# Altium schematic sheet mcu.SchDoc
size A; SheetNumber: 2; SheetTotal: 3; SPICEModelCacheWLBWUGVA: <root> / <DocumentId>WLBWUGVA</DocumentId> / </root>
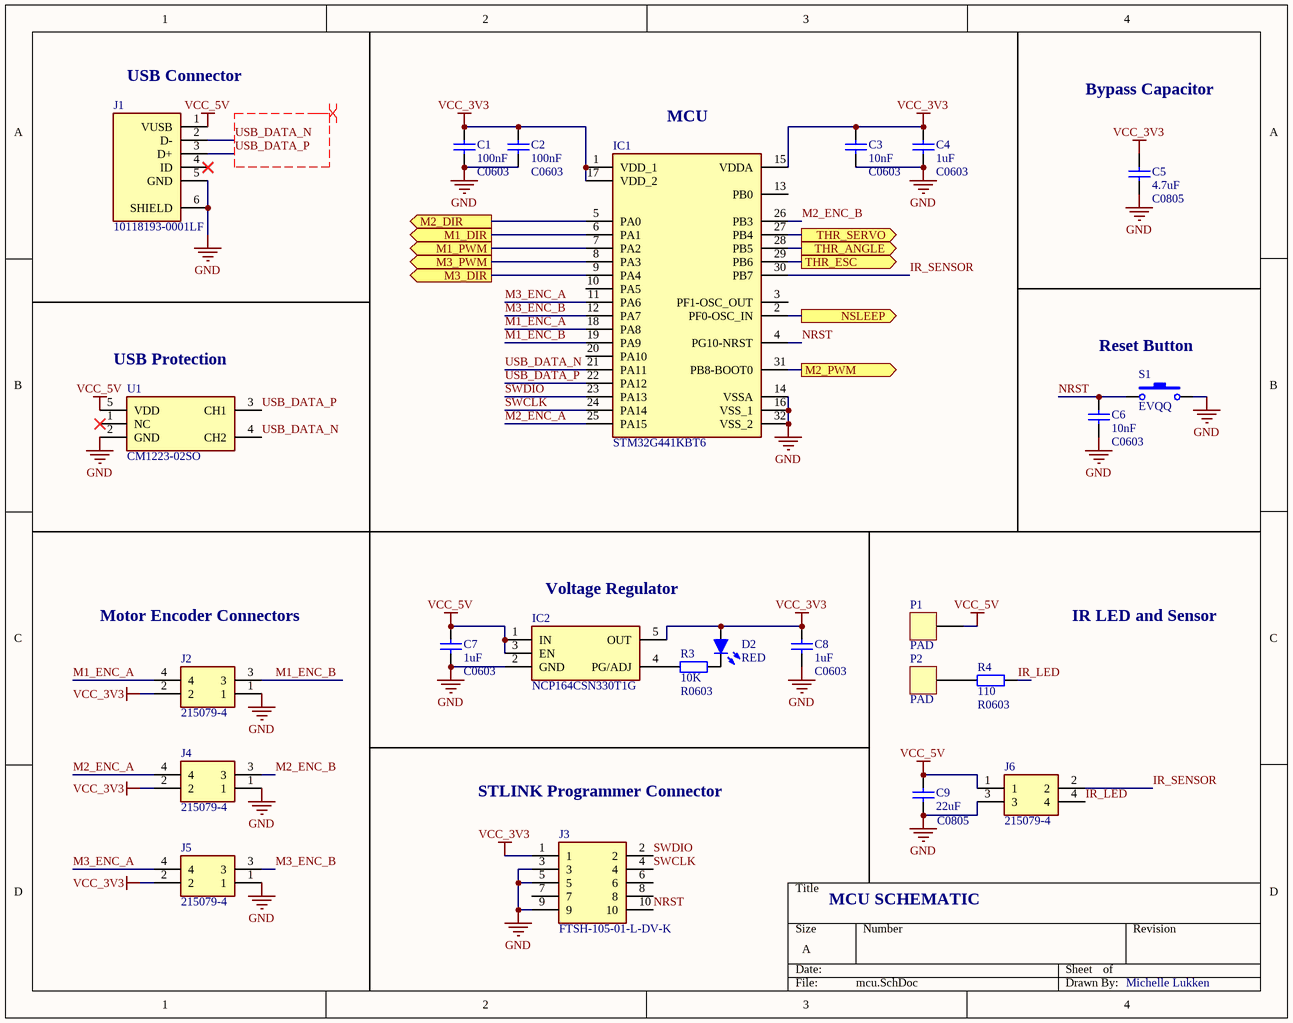
[diagram p0: mcu.SchDoc]

## Parts
C1  Capacitance: 100nF  [C0603]
C2  Capacitance: 100nF  [C0603]
C3  Capacitance: 10nF  [C0603]
C4  Capacitance: 1uF  [C0603]
C5  Capacitance: 4.7uF  [C0805]
C6  Capacitance: 10nF  [C0603]
C7  Capacitance: 1uF  [C0603]
C8  Capacitance: 1uF  [C0603]
C9  Capacitance: 22uF  [C0805]
D2  Colour: RED  [LED_0603]  (hidden comment: LED)
IC1  STM32G441KBT6  [QFP80P900X900X160-32N]
IC2  NCP164CSN330T1G  [SOT95P275X110-5N]
J1  10118193-0001LF  [101181930001LF]
J2  215079-4  [2150794]
J3  FTSH-105-01-L-DV-K  [FTSH10501LDVK]
J4  215079-4  [2150794]
J5  215079-4  [2150794]
J6  215079-4  [2150794]
P1  PAD  [PAD]
P2  PAD  [PAD]
R3  10K  [R0603]
R4  110  [R0603]
S1  EVQQ  [EVQQ]
U1  CM1223-02SO  [SOT95P280X145-5N]

## Ports
M1_DIR (out, see top_overview[1A]), M1_PWM (out, see top_overview[1A]), M2_DIR (out, see top_overview[1B]), M2_PWM (out, see top_overview[1B]), M3_DIR (out, see top_overview[1B]), M3_PWM (out, see top_overview[1B]), NSLEEP (out, see top_overview[1A]), THR_ANGLE (out, see top_overview[1B]), THR_ESC (out, see top_overview[1B]), THR_SERVO (out, see top_overview[1B])

## Nets
GND: C1.1 C2.1 C3.1 C4.1 C5.1 C6.1 C7.1 C8.1 C9.2 IC1.14(VSSA) IC1.16(VSS_1) IC1.32(VSS_2) IC2.2(GND) J1.5(GND) J1.6(SHIELD) J2.1 J3.3 J3.5 J3.9 J4.1 J5.1 J6.3 S1.2 U1.2(GND)
VCC_3V3: C1.2 C2.2 C3.2 C4.2 C5.2 C8.2 D2.1(A) IC1.1(VDD_1) IC1.15(VDDA) IC1.17(VDD_2) IC2.5(OUT) J2.2 J3.1 J4.2 J5.2
VCC_5V: C7.2 C9.1 IC2.1(IN) IC2.3(EN) J1.1(VUSB) J6.1 P1.1(PAD) U1.5(VDD)
IR_LED: J6.4 R4.2
IR_SENSOR: IC1.30(PB7) J6.2
M1_DIR: IC1.6(PA1) ; port M1_DIR
M1_ENC_A: IC1.18(PA8) J2.4
M1_ENC_B: IC1.19(PA9) J2.3
M1_PWM: IC1.7(PA2) ; port M1_PWM
M2_DIR: IC1.5(PA0) ; port M2_DIR
M2_ENC_A: IC1.25(PA15) J4.4
M2_ENC_B: IC1.26(PB3) J4.3
M2_PWM: IC1.31(PB8-BOOT0) ; port M2_PWM
M3_DIR: IC1.9(PA4) ; port M3_DIR
M3_ENC_A: IC1.11(PA6) J5.4
M3_ENC_B: IC1.12(PA7) J5.3
M3_PWM: IC1.8(PA3) ; port M3_PWM
NRST: C6.2 IC1.4(PG10-NRST) J3.10 S1.1
NSLEEP: IC1.2(PF0-OSC_IN) ; port NSLEEP
SWCLK: IC1.24(PA14) J3.4
SWDIO: IC1.23(PA13) J3.2
THR_ANGLE: IC1.28(PB5) ; port THR_ANGLE
THR_ESC: IC1.29(PB6) ; port THR_ESC
THR_SERVO: IC1.27(PB4) ; port THR_SERVO
USB_DATA_N: IC1.21(PA11) J1.2(D-) U1.4(CH2)
USB_DATA_P: IC1.22(PA12) J1.3(D+) U1.3(CH1)
NetD2_2: D2.2(K) R3.1
NetIC2_4: IC2.4(PG/ADJ) R3.2
NetP2_1: P2.1(PAD) R4.1

Not connected (* = marked no-connect by the designer): IC1 3(PF1-OSC_OUT) 10(PA5) 13(PB0) 20(PA10); J1 4(ID)*; J3 6 7 8; U1 1(NC)*

## Layout directives
differential pair; differential pair class USB: USB_DATA_N, USB_DATA_P

## Notes on the sheet
- (near J1) USB Connector
- Bypass Capacitor
- (near IC1) MCU
- (near U1) USB Protection
- Reset Button
- Motor Encoder Connectors
- Voltage Regulator
- IR LED and Sensor
- STLINK Programmer Connector
- MCU SCHEMATIC
- Michelle Lukken

## Library data of the parts
C1-C9 = Capacitor: Ceramic capacitor; Type: MLCC; Voltage rating: *V; ComponentLinknDescription: Datasheet; Characteristic: *; Manufacturer: *; ComponentLinknURL: *
  C1-C4 C6-C8: Note: C0603
  C5 C9: Note: C0805
D2 = LED: Light Emitting Diode; ComponentLinknDescription: Datasheet; Space heritage: false; Current rating: *mA; Power dissipation: false; Drawn by: *
IC1 = STM32G441KBT6: Integrated Circuit; Manufacturer_Name: STMicroelectronics; Datasheet Link: https://www.st.com/resource/en/datasheet/stm32g441cb.pdf; Height: 1.6mm; Manufacturer_Part_Number: STM32G441KBT6; Mouser Part Number: 511-STM32G441KBT6; Mouser Price/Stock: https://www.mouser.co.uk/ProductDetail/STMicroelectronics/STM32G441KBT6?qs=uwxL4vQweFMT5Uxfs2PTag%3D%3D
IC2 = NCP164CSN330T1G: Integrated Circuit; Manufacturer_Name: onsemi; Datasheet Link: https://componentsearchengine.com/Datasheets/2/NCP164CSN330T1G.pdf; Height: 1.1mm; Manufacturer_Part_Number: NCP164CSN330T1G; Mouser Part Number: 863-NCP164CSN330T1G; Mouser Price/Stock: https://www.mouser.co.uk/ProductDetail/onsemi/NCP164CSN330T1G?qs=xZ%2FP%252Ba9zWqbi%2FAyy5UtoRw%3D%3D; Arrow Part Number: NCP164CSN330T1G; Arrow Price/Stock: https://www.arrow.com/en/products/ncp164csn330t1g/on-semiconductor?region=nac
J1 = 10118193-0001LF: Connector; Manufacturer_Name: AMPHENOL COMMUNICATION SOLUTIONS; Datasheet Link: https://cdn.amphenol-icc.com/media/wysiwyg/files/drawing/10118193.pdf; Height: 3.3mm; Manufacturer_Part_Number: 10118193-0001LF
J2 J4-J6 = 215079-4: Connector; Manufacturer_Name: TE Connectivity; Datasheet Link: https://www.te.com/commerce/DocumentDelivery/DDEController?Action=srchrtrv&DocNm=215079&DocType=Customer+Drawing&DocLang=English; Height: 4.2mm; Manufacturer_Part_Number: 215079-4; Mouser Part Number: 571-215079-4; Mouser Price/Stock: https://www.mouser.co.uk/ProductDetail/TE-Connectivity/215079-4?qs=O3N86PA0UL%252BdoZEVcFx8sQ%3D%3D; Arrow Part Number: 215079-4; Arrow Price/Stock: https://www.arrow.com/en/products/215079-4/te-connectivity
J3 = FTSH-105-01-L-DV-K: Connector; Manufacturer_Name: SAMTEC; Datasheet Link: https://www.arrow.com/en/products/ftsh-105-01-l-dv-k/samtec; Height: 6.1mm; Manufacturer_Part_Number: FTSH-105-01-L-DV-K; Mouser Part Number: 200-FTSH10501LDVK; Mouser Price/Stock: https://www.mouser.co.uk/ProductDetail/Samtec/FTSH-105-01-L-DV-K?qs=%252B5JSS813miOqo3Vy%252BvhCFg%3D%3D; Arrow Part Number: FTSH-105-01-L-DV-K; Arrow Price/Stock: https://www.arrow.com/en/products/ftsh-105-01-l-dv-k/samtec?region=europe
R3 R4 = Resistor: Precision: *%; Voltage rating: *V; Temp coefficient: *ppm; Power rating: *mW; ComponentLinknDescription: Datasheet; Manufacturer: *; ComponentLinknURL: *; Note: R0603
  R3: Resistance: 10K
  R4: Resistance: 110
S1 = EVQQ: Switch; Manufacturer: Panasonic; ComponentLinknDescription: Datasheet; Space heritage: false; Drawn by: Erik Ilbis; Verified: false; Part number: EVQQ
U1 = CM1223-02SO: TVS diodes 2-ch; Manufacturer_Name: Texas Instruments; Manufacturer_Part_Number: INA139NA; Datasheet Link: https://componentsearchengine.com/Datasheets/2/INA139NA.pdf; Height: 1.45mm